# Altium schematic sheet FIT_HDMI_X32-26.SchDoc: FIT_PM12 board
size 420 x 297 mm; CheckedBy: G.Kasprowicz; Author: INR Moscow; CompanyName: WUT ISE; DrawnBy: M.Podgórski; Organization: WUT ISE; Address1: PW ISE; Address2: Nowowiejska 15/19 00-665 Warsaw; Address3: gkasprow@gmail.com; Revision: 2; SheetNumber: -; SheetTotal: -; ModifiedBy: -; CheckedDate: -; Title2: Title 2; DivGrp: WUT ISE; Designer: INR RAS; ModifiedDate: -; ProjectName: Sensor Box
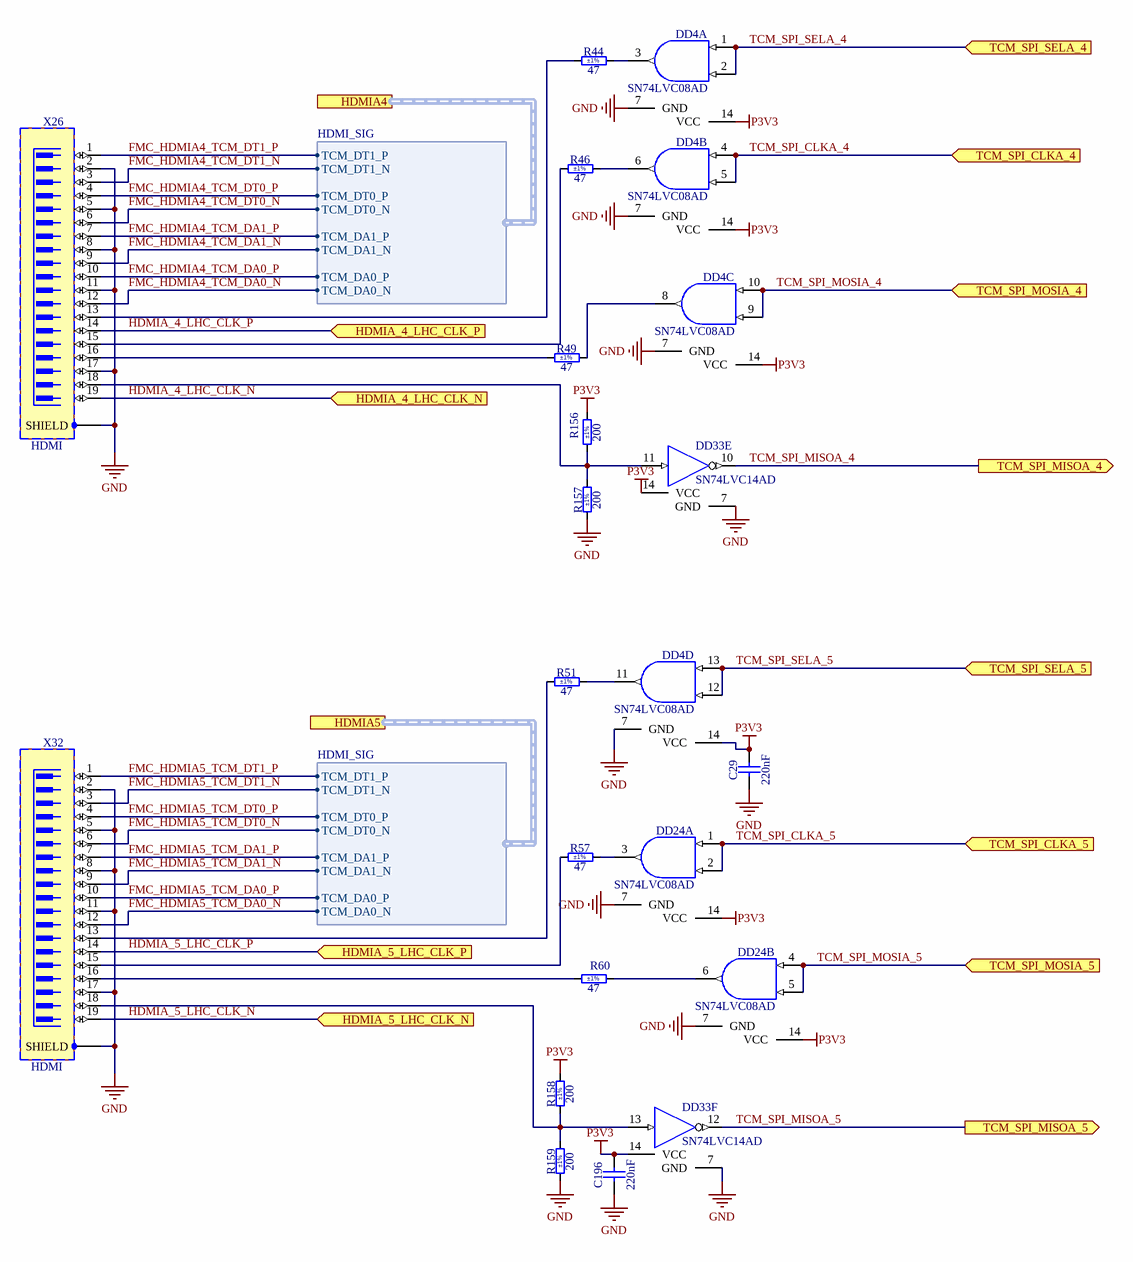
[diagram p0: FIT_HDMI_X32-26.SchDoc]

## Parts
C29  220nF  [CAPC2012X135N]
C196  220nF  [CAPC2012X135N]
DD4  SN74LVC08AD  [SOIC127P600X175-14N]  (parts A,B,C,D of 4)
DD24  SN74LVC08AD  [SOIC127P600X175-14N]  (parts A,B of 4)
DD33  SN74LVC14AD  [SOIC127P600X175-14N]  (parts E,F of 6)
R44  47  Tolerance: ±1%  [RESC2012X60N]
R46  47  Tolerance: ±1%  [RESC2012X60N]
R49  47  Tolerance: ±1%  [RESC2012X60N]
R51  47  Tolerance: ±1%  [RESC2012X60N]
R57  47  Tolerance: ±1%  [RESC2012X60N]
R60  47  Tolerance: ±1%  [RESC2012X60N]
R156  200  Tolerance: ±1%  [RESC2012X60N]
R157  200  Tolerance: ±1%  [RESC2012X60N]
R158  200  Tolerance: ±1%  [RESC2012X60N]
R159  200  Tolerance: ±1%  [RESC2012X60N]
X26  HDMI  [TYCO_2007435-1]
X32  HDMI  [TYCO_2007435-1]

## Ports
HDMIA4 (harness HDMI_SIG), HDMIA5 (harness HDMI_SIG), HDMIA_4_LHC_CLK_N (in), HDMIA_4_LHC_CLK_P (in), HDMIA_5_LHC_CLK_N (in), HDMIA_5_LHC_CLK_P (in), TCM_SPI_CLKA_4 (in), TCM_SPI_CLKA_5 (in), TCM_SPI_MISOA_4 (out), TCM_SPI_MISOA_5 (out), TCM_SPI_MOSIA_4 (in), TCM_SPI_MOSIA_5 (in), TCM_SPI_SELA_4 (in), TCM_SPI_SELA_5 (in)

## Harnesses
HDMI_SIG: TCM_DT1_P, TCM_DT1_N, TCM_DT0_P, TCM_DT0_N, TCM_DA1_P, TCM_DA1_N, TCM_DA0_P, TCM_DA0_N

## Nets
GND: C29.1 C196.1 DD4.7(GND) DD24.7(GND) DD33.7(GND) R157.1 R159.1 X26.2 X26.5 X26.8 X26.11 X26.17 X26.SHIELD X32.2 X32.5 X32.8 X32.11 X32.17 X32.SHIELD
P3V3: C29.2 C196.2 DD4.14(VCC) DD24.14(VCC) DD33.14(VCC) R156.2 R158.2  [also labelled VCC]
FMC_HDMIA4_TCM_DA0_N: X26.12 ; port HDMIA4.TCM_DA0_N
FMC_HDMIA4_TCM_DA0_P: X26.10 ; port HDMIA4.TCM_DA0_P
FMC_HDMIA4_TCM_DA1_N: X26.9 ; port HDMIA4.TCM_DA1_N
FMC_HDMIA4_TCM_DA1_P: X26.7 ; port HDMIA4.TCM_DA1_P
FMC_HDMIA4_TCM_DT0_N: X26.6 ; port HDMIA4.TCM_DT0_N
FMC_HDMIA4_TCM_DT0_P: X26.4 ; port HDMIA4.TCM_DT0_P
FMC_HDMIA4_TCM_DT1_N: X26.3 ; port HDMIA4.TCM_DT1_N
FMC_HDMIA4_TCM_DT1_P: X26.1 ; port HDMIA4.TCM_DT1_P
FMC_HDMIA5_TCM_DA0_N: X32.12 ; port HDMIA5.TCM_DA0_N
FMC_HDMIA5_TCM_DA0_P: X32.10 ; port HDMIA5.TCM_DA0_P
FMC_HDMIA5_TCM_DA1_N: X32.9 ; port HDMIA5.TCM_DA1_N
FMC_HDMIA5_TCM_DA1_P: X32.7 ; port HDMIA5.TCM_DA1_P
FMC_HDMIA5_TCM_DT0_N: X32.6 ; port HDMIA5.TCM_DT0_N
FMC_HDMIA5_TCM_DT0_P: X32.4 ; port HDMIA5.TCM_DT0_P
FMC_HDMIA5_TCM_DT1_N: X32.3 ; port HDMIA5.TCM_DT1_N
FMC_HDMIA5_TCM_DT1_P: X32.1 ; port HDMIA5.TCM_DT1_P
HDMIA_4_LHC_CLK_N: X26.19 ; port HDMIA_4_LHC_CLK_N
HDMIA_4_LHC_CLK_P: X26.14 ; port HDMIA_4_LHC_CLK_P
HDMIA_5_LHC_CLK_N: X32.19 ; port HDMIA_5_LHC_CLK_N
HDMIA_5_LHC_CLK_P: X32.14 ; port HDMIA_5_LHC_CLK_P
TCM_SPI_CLKA_4: DD4.4(A) DD4.5(B) ; port TCM_SPI_CLKA_4
TCM_SPI_CLKA_5: DD24.1(A) DD24.2(B) ; port TCM_SPI_CLKA_5
TCM_SPI_MISOA_4: DD33.10(OUT) ; port TCM_SPI_MISOA_4
TCM_SPI_MISOA_5: DD33.12(OUT) ; port TCM_SPI_MISOA_5
TCM_SPI_MOSIA_4: DD4.9(B) DD4.10(A) ; port TCM_SPI_MOSIA_4
TCM_SPI_MOSIA_5: DD24.4(A) DD24.5(B) ; port TCM_SPI_MOSIA_5
TCM_SPI_SELA_4: DD4.1(A) DD4.2(B) ; port TCM_SPI_SELA_4
TCM_SPI_SELA_5: DD4.12(B) DD4.13(A) ; port TCM_SPI_SELA_5
NetDD4_3: DD4.3(Y) R44.2
NetDD4_6: DD4.6(Y) R46.2
NetDD4_8: DD4.8(Y) R49.2
NetDD4_11: DD4.11(Y) R51.2
NetDD24_3: DD24.3(Y) R57.2
NetDD24_6: DD24.6(Y) R60.2
NetDD33_11: DD33.11(IN) R156.1 R157.2 X26.18
NetDD33_13: DD33.13(IN) R158.1 R159.2 X32.18
NetR44_1: R44.1 X26.13
NetR46_1: R46.1 X26.15
NetR49_1: R49.1 X26.16
NetR51_1: R51.1 X32.13
NetR57_1: R57.1 X32.15
NetR60_1: R60.1 X32.16

## Notes on the sheet
- Project/Equipment
- Document
- Designer
- Drawn by
- Check.by
- Copyright WUT ISE 2024.
  This documentation describes Open Hardware and is licensed under the CERN OHL v.2. You may redistribute and modify this documentation under the terms of the CERN OHL v.2. (http://ohwr.org/CERNOHL). This documentation is distributed WITHOUT ANY EXPRESS OR IMPLIED WARRANTY, INCLUDING OF MERCHANTABILITY, SATISFACTORY QUALITY AND FITNESS FOR A PARTICULAR PURPOSE. Please see the CERN OHL v.2 for applicable conditions.
- Contact
- File
- Last Mod.
- Print Date
- Sheet
- Size
- A3
- of
- Rev

## Library data of the parts
C29 C196 = CC0805_220NF_50V_10%_X7R: Non-polarised capacitor; Part Description: SMD Multilayer Chip Ceramic Capacitor; Manufacturer: GENERIC; Manufacturer1 Part Number: GRM21BR71H224KA01L; Voltage: 50V; TC: X7R; Tolerance: ±10%; Part Number: CC0805_220NF_50V_10%_X7R; Component Kind: Standard; Component Type: Standard; Pin Count: 2; Value: 220nF; Status: Preferred; Manufacturer Part Number: CC0805_220NF_50V_10%_X7R; Case: 0805; Mounted: Yes; Socket: No; SMD: Yes; Sense: No; Manufacturer1 Example: MURATA; Manufacturer1 ComponentHeight: 1.35mm; HelpURL: \\cern.ch\dfs\Applications\Altium\Datasheets\CC0805_X7R_MURATA.pdf; Author: CERN DEM JLC; CreateDate: 03.12.2007; LatestRevisionDate: 03.12.2007
DD4 DD24 = SN74LVC08AD: Quad 2-Input AND Gate; Part Description: Quadruple 2-Input Positive-AND Gate; Manufacturer: TEXAS INSTRUMENTS; PressFit: No; Bonding: No; Part Number: SN74LVC08AD; Component Kind: Standard; Component Type: Standard; Device: SN74LVC08AD; PackageDescription: SOIC 14, Pitch 1.27mm - Body 4x8.75mm, IPC Medium Density; Manufacturer Part Number: SN74LVC08AD; Pin Count: 14; Case: SOIC14; Mounted: Yes; Socket: No; SMD: Yes; Sense: No; ComponentHeight: 1.75mm; Author: CERN DEM JLC; HelpURL: \\cern.ch\dfs\Applications\Altium\Datasheets\SN74LVC08AD.pdf; CreateDate: 21.03.2012; LatestRevisionDate: 21.03.2012
DD33 = SN74LVC14AD: Hex Schmitt-Trigger Inverter; Manufacturer: TEXAS INSTRUMENTS; PressFit: No; Bonding: No; Part Number: SN74LVC14AD; Component Kind: Standard; Component Type: Standard; Device: SN74LVC14AD; PackageDescription: SOIC 14, Pitch 1.27mm - Body 4x8.75mm, IPC Medium Density; Part Description: Hex Schmitt-Trigger Inverter; Manufacturer Part Number: SN74LVC14AD; Pin Count: 14; Case: SOIC14; Mounted: Yes; Socket: No; SMD: Yes; Sense: No; ComponentHeight: 1.75mm; Author: CERN DEM JMW; HelpURL: \\cern.ch\dfs\Applications\Altium\Datasheets\SN74LVC14AD.pdf; CreateDate: 29.09.2008; LatestRevisionDate: 29.09.2008
R44 R46 R49 R51 R57 R60 = R0805_47R_1%_0.125W_100PPM: Resistor - 1%; Part Description: General Purpose Thick Film Chip Resistor; Manufacturer: GENERIC; Manufacturer1 Part Number: NRC10F47R0TRF; Power: 0.125W; TC: ±100ppm/°C; PressFit: No; Part Number: R0805_47R_1%_0.125W_100PPM; Component Kind: Standard; Component Type: Standard; Pin Count: 2; Value: 47; Status: Preferred; Manufacturer Part Number: R0805_47R_1%_0.125W_100PPM; Case: 0805; Mounted: Yes; Sense: No; Socket: No; SMD: Yes; Manufacturer1 Example: NIC COMPONENT; Manufacturer1 ComponentHeight: 0.6mm; HelpURL: \\cern.ch\dfs\Applications\Altium\Datasheets\R0805_NIC_NRC.pdf; Author: CERN DEM JLC; CreateDate: 03.12.2007; LatestRevisionDate: 13.03.2008
R156-R159 = R0805_200R_1%_0.125W_100PPM: Resistor - 1%; Part Description: General Purpose Thick Film Chip Resistor; Manufacturer: GENERIC; Manufacturer1 Part Number: NRC10F2000TRF; Power: 0.125W; TC: ±100ppm/°C; PressFit: No; Part Number: R0805_200R_1%_0.125W_100PPM; Component Kind: Standard; Component Type: Standard; Pin Count: 2; Value: 200; Status: Preferred; Manufacturer Part Number: R0805_200R_1%_0.125W_100PPM; Case: 0805; Mounted: Yes; Sense: No; Socket: No; SMD: Yes; Manufacturer1 Example: NIC COMPONENT; Manufacturer1 ComponentHeight: 0.6mm; HelpURL: \\cern.ch\dfs\Applications\Altium\Datasheets\R0805_NIC_NRC.pdf; Author: CERN DEM JLC; CreateDate: 03.12.2007; LatestRevisionDate: 13.03.2008
X26 X32 = TYCO_2007435-1: Connector HDMI 19 Male + 1 Shield; Part Description: 0.578mm Pitch, Through-Hole Right Angle 19 Contacts Flag-HDMI Type-A Receptacle Thru Hole Mounting Pads; Manufacturer: TYCO ELECTRONICS; PressFit: No; Part Number: TYCO_2007435-1; Component Kind: Standard; Component Type: Standard; Pin Count: 23; Family: HDMI; Mounted: Yes; Socket: No; SMD: No; Sense: No; Status: None; Manufacturer Part Number: 2007435-1; ComponentHeight: 16.4mm; HelpURL: \\cern.ch\dfs\Applications\Altium\Datasheets\TYCO_2007435-1.pdf; Author: CERN DEM MR; CreateDate: 05.07.2016; LatestRevisionDate: 05.07.2016